# Altium schematic sheet Schematic.schdoc
size 105 x 86 mm
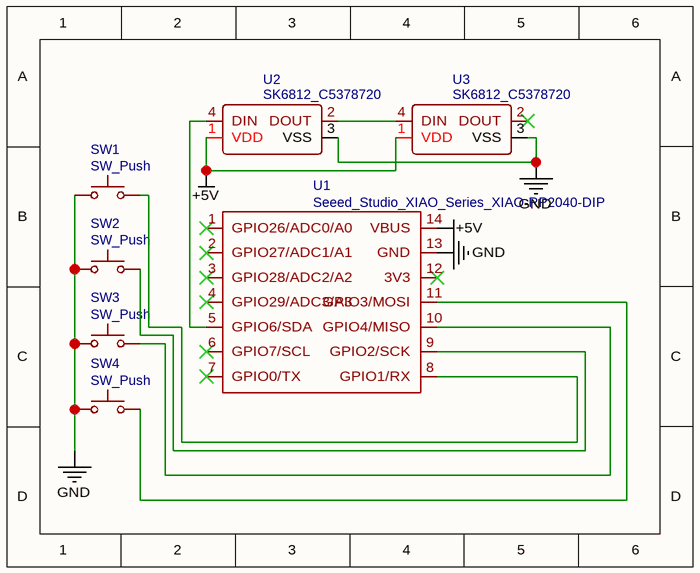
[diagram p0: Schematic.schdoc]

## Parts
SW1  SW_Push  [SW_CHERRY_MX_1.00U_PCB]
SW2  SW_Push  [SW_CHERRY_MX_1.00U_PCB]
SW3  SW_Push  [SW_CHERRY_MX_1.00U_PCB]
SW4  SW_Push  [SW_CHERRY_MX_1.00U_PCB]
U1  Seeed_Studio_XIAO_Series_XIAO-RP2040-DIP  [VARISTOR:XIAO-RP2040-DIP]
U2  SK6812_C5378720  [LED-SMD_4P-L5.0-W5.0-LS5.4-TL-1]
U3  SK6812_C5378720  [LED-SMD_4P-L5.0-W5.0-LS5.4-TL-1]

## Nets
+5V: U1.14(VBUS) U2.1(VDD) U3.1(VDD)
GND: SW1.1 SW2.1 SW3.1 SW4.1 U1.13(GND) U2.3(VSS) U3.3(VSS)
NetSW1_2: SW1.2 U1.8(GPIO1/RX)
NetSW2_2: SW2.2 U1.9(GPIO2/SCK)
NetSW3_2: SW3.2 U1.10(GPIO4/MISO)
NetSW4_2: SW4.2 U1.11(GPIO3/MOSI)
NetU1_5: U1.5(GPIO6/SDA) U2.4(DIN)
NetU2_2: U2.2(DOUT) U3.4(DIN)

Not connected (* = marked no-connect by the designer): U1 1(GPIO26/ADC0/A0)* 2(GPIO27/ADC1/A1)* 3(GPIO28/ADC2/A2)* 4(GPIO29/ADC3/A3)* 6(GPIO7/SCL)* 7(GPIO0/TX)* 12(3V3)*; U3 2(DOUT)*

## Library data of the parts
SW1-SW4 = SW_Push: Contributor: KiCAD; license: https://www.gnu.org/licenses/lgpl-2.1.html; spicePre: S; spiceSymbolName: SW_Push
U1 = Seeed_Studio_XIAO_Series_XIAO-RP2040-DIP: Add into BOM: yes; Contributor: ryantaw; Symbol: Seeed_Studio_XIAO_Series_XIAO-RP2040-DIP; Device: Seeed_Studio_XIAO_Series_XIAO-RP2040-DIP; Convert to PCB: yes; spicePre: U; spiceSymbolName: Seeed_Studio_XIAO_Series_XIAO-RP2040-DIP
U2 U3 = SK6812_C5378720: Manufacturer: 欧思科光电; Manufacturer Part: SK6812; Contributor: lcsc; Supplier: LCSC; Supplier Part: C5378720; JLCPCB Part Class: Extended Part; spicePre: U; spiceSymbolName: SK6812_C5378720